# Altium schematic sheet VoltageSense.SchDoc
size A; SheetNumber: 2; SheetTotal: 10
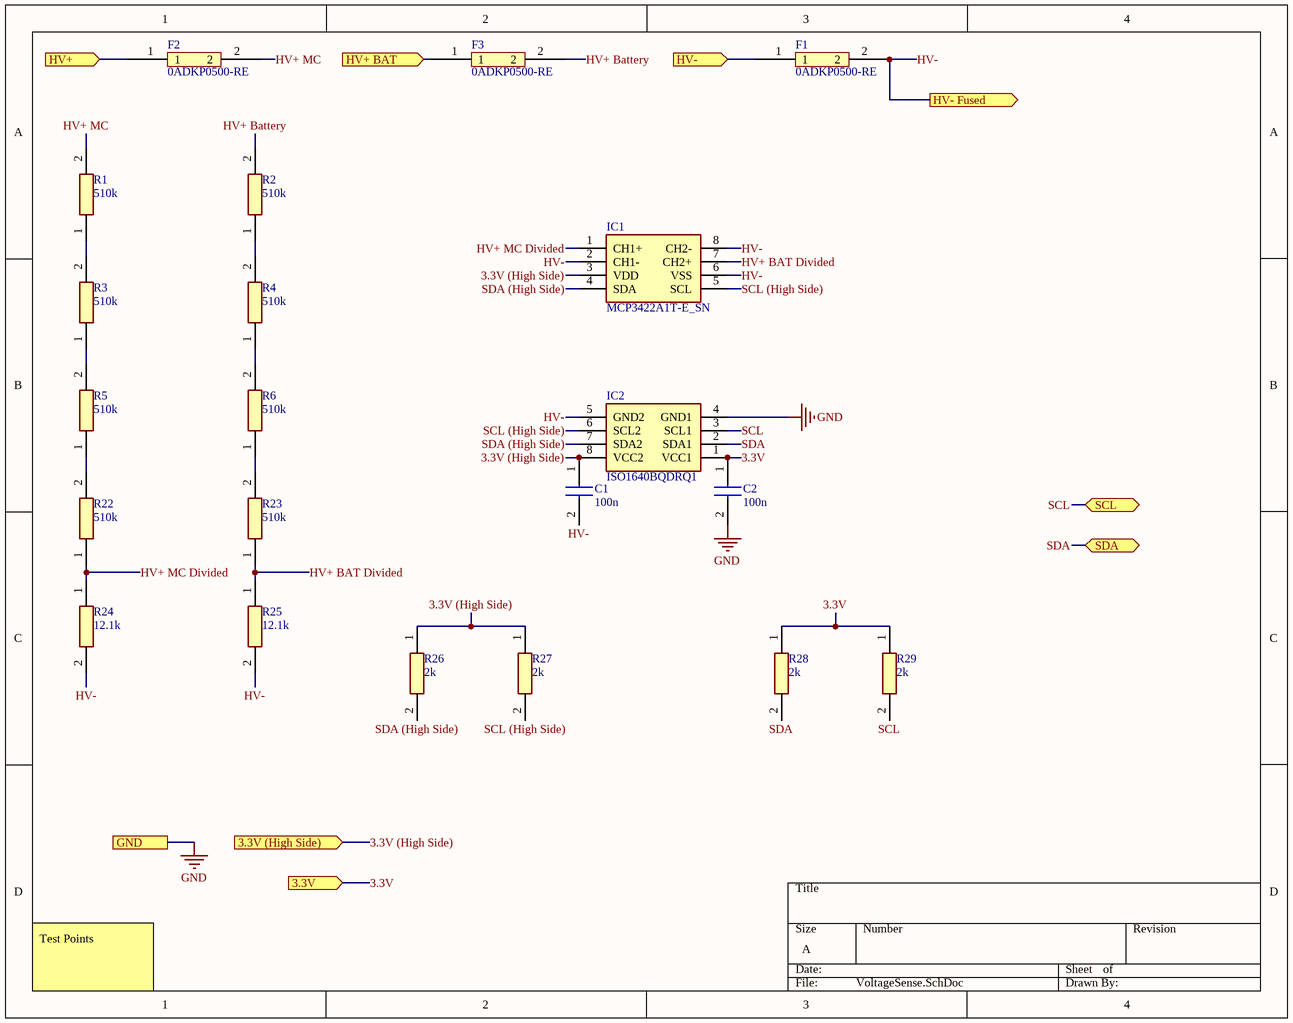
[diagram p0: VoltageSense.SchDoc]

## Parts
C1  100n  [CAPC3216X94N]
C2  100n  [CAPC3216X94N]
F1  0ADKP0500-RE  [0ADKP0500-RE]
F2  0ADKP0500-RE  [0ADKP0500-RE]
F3  0ADKP0500-RE  [0ADKP0500-RE]
IC1  MCP3422A1T-E_SN  [SOIC127P600X175-8N]
IC2  ISO1640BQDRQ1  [SOIC127P600X175-8N]
R1  510k  [RESC3216X75N]
R2  510k  [RESC3216X75N]
R3  510k  [RESC3216X75N]
R4  510k  [RESC3216X75N]
R5  510k  [RESC3216X75N]
R6  510k  [RESC3216X75N]
R22  510k  [RESC3216X75N]
R23  510k  [RESC3216X75N]
R24  12.1k  [ERA6AEB101V]
R25  12.1k  [ERA6AEB101V]
R26  2k  [RESC3116X65N]
R27  2k  [RESC3116X65N]
R28  2k  [RESC3116X65N]
R29  2k  [RESC3116X65N]

## Ports
3.3V (High Side) (in), 3.3V (in), GND, HV+ (in), HV+ BAT (in), HV- (in), HV- Fused (out), SCL (bidir), SDA (bidir)

## Nets
GND: C2.2 IC2.4(GND1) ; port GND
3.3V: C2.1 IC2.1(VCC1) R28.1 R29.1 ; port 3.3V
3.3V (High Side): C1.1 IC1.3(VDD) IC2.8(VCC2) R26.1 R27.1 ; port 3.3V (High Side)
HV+: F2.1 ; port HV+
HV+ BAT: F3.1 ; port HV+ BAT
HV+ BAT Divided: IC1.7(CH2+) R23.1 R25.1
HV+ Battery: F3.2 R2.2
HV+ MC: F2.2 R1.2
HV+ MC Divided: IC1.1(CH1+) R22.1 R24.1
HV-: C1.2 F1.2 IC1.2(CH1-) IC1.6(VSS) IC1.8(CH2-) IC2.5(GND2) R24.2 R25.2 ; port HV- Fused
HV-: F1.1 ; port HV-  [a separate net that carries the same name]
SCL: IC2.3(SCL1) R29.2 ; port SCL
SCL (High Side): IC1.5(SCL) IC2.6(SCL2) R27.2
SDA: IC2.2(SDA1) R28.2 ; port SDA
SDA (High Side): IC1.4(SDA) IC2.7(SDA2) R26.2
NetR1_1: R1.1 R3.2
NetR2_1: R2.1 R4.2
NetR3_1: R3.1 R5.2
NetR4_1: R4.1 R6.2
NetR5_1: R5.1 R22.2
NetR6_1: R6.1 R23.2

## Notes on the sheet
- Test Points

## Library data of the parts
C1 C2 = 12065C104J4Z2A: Capacitor; Manufacturer_Name: Kyocera AVX; Datasheet Link: https://spicat.kyocera-avx.com/product/mlcc/chartview/12065C104J4Z2A/DataSheet/X7R; Height: 0.94mm; Manufacturer_Part_Number: 12065C104J4Z2A; Mouser Part Number: 581-12065C104J4Z2A; Mouser Price/Stock: https://www.mouser.com/Search/Refine.aspx?Keyword=581-12065C104J4Z2A
F1-F3 = 0ADKP0500-RE: Fuse
IC1 = MCP3422A1T-E_SN: Integrated Circuit; Manufacturer_Name: Microchip; Manufacturer_Part_Number: MCP3422A1T-E/SN; Datasheet Link: https://ww1.microchip.com/downloads/en/DeviceDoc/22088c.pdf; Height: 1.75mm; Mouser Part Number: 579-MCP3422A1T-E/SN; Mouser Price/Stock: https://www.mouser.co.uk/ProductDetail/Microchip-Technology/MCP3422A1T-E-SN?qs=X98pPdo4MrvBbe3HwfJ%252Bfw%3D%3D; Arrow Part Number: MCP3422A1T-E/SN; Arrow Price/Stock: https://www.arrow.com/en/products/mcp3422a1t-esn/microchip-technology
IC2 = ISO1640BQDRQ1: Integrated Circuit; Manufacturer_Name: Texas Instruments; Datasheet Link: https://www.ti.com/lit/ds/symlink/iso1640.pdf; Height: 1.75mm; Manufacturer_Part_Number: ISO1640BQDRQ1; Mouser Part Number: 595-ISO1640BQDRQ1; Mouser Price/Stock: https://www.mouser.co.uk/ProductDetail/Texas-Instruments/ISO1640BQDRQ1?qs=QNEnbhJQKvat3Z1mRPODGw%3D%3D; Arrow Part Number: ISO1640BQDRQ1; Arrow Price/Stock: https://www.arrow.com/en/products/iso1640bqdrq1/texas-instruments?region=nac
R1-R6 R22 R23 = CR1206-FX-5103ELF: Resistor; Manufacturer_Name: Bourns; Datasheet Link: http://componentsearchengine.com/Datasheets/1/CR1206-FX-5103ELF.pdf; Height: 0.75mm; Manufacturer_Part_Number: CR1206-FX-5103ELF; Mouser Part Number: 652-CR1206FX-5103ELF; Mouser Price/Stock: https://www.mouser.co.uk/ProductDetail/Bourns/CR1206-FX-5103ELF?qs=O4EQhShwvrpqwloF6Ll%2FVg%3D%3D; Arrow Part Number: CR1206-FX-5103ELF; Arrow Price/Stock: https://www.arrow.com/en/products/cr1206-fx-5103elf/bourns?region=europe
R24 R25 = ERA-6AEB1212V: Resistor; Manufacturer_Name: Panasonic; Datasheet Link: https://industrial.panasonic.com/cdbs/www-data/pdf/RDM0000/AOA0000C307.pdf; Height: 0.6mm; Manufacturer_Part_Number: ERA-6AEB1212V; Mouser Part Number: 667-ERA-6AEB1212V; Mouser Price/Stock: https://www.mouser.co.uk/ProductDetail/Panasonic/ERA-6AEB1212V?qs=DyUWGjl%252BcVvcV08sco2Dng%3D%3D
R26-R29 = CHP1206AFX-2001ELF: Resistor; Manufacturer_Name: Bourns; Datasheet Link: https://www.mouser.mx/datasheet/2/54/chp-a-1858677.pdf; Height: 0.65mm; Manufacturer_Part_Number: CHP1206AFX-2001ELF; Mouser Part Number: 652-CHP1206AFX-2001L; Mouser Price/Stock: https://www.mouser.co.uk/ProductDetail/Bourns/CHP1206AFX-2001ELF?qs=GedFDFLaBXERFI3Dnxqg6Q%3D%3D